# Altium schematic sheet lm7805-power-supply.SchDoc
size 420 x 297 mm; Author: ALTIUM GOSTBOM2.0 KEV; SheetNumber: 1; SheetTotal: 1
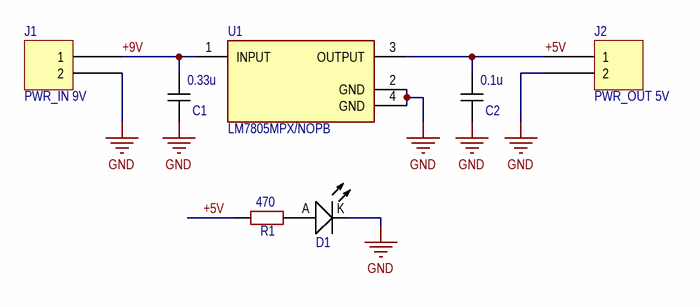
[diagram p0: lm7805-power-supply.SchDoc]

## Parts
C1  0.33u  [CAP_CER_1206]
C2  0.1u  [CAP_CER_1206]
D1  Bl 0603  [LED-0603-BLUE]  (value not drawn)
J1  PWR_IN 9V  [TE 282837-2]
J2  PWR_OUT 5V  [TE 282837-2]
R1  470  [RESC1608(0603)N]
U1  LM7805MPX/NOPB  [FP-LM7805MPX-NOPB-MFG]

## Nets
GND: C1.1 C2.1 D1.K J1.2 J2.2 U1.2(GND) U1.4(GND)
+5V: C2.2 J2.1 R1.1 U1.3(OUTPUT)
+9V: C1.2 J1.1 U1.1(INPUT)
NetD1_A: D1.A R1.2

## Notes on the sheet
- Перв. примен.
- Справ. №
- Подп. дата
- Инв. № дубл.
- Взам. инв. №
- Подп. и дата
- Изм.
- Разраб.
- Лист
- № докум.
- Подп.
- Дата
- Лит.
- Масса
- Масштаб
- Пров.
- Т.контр.
- Листов
- Инв. № подл.
- Н.контр.
- Утв.
- ALTIUM GOSTBOM2.0 KEV
- Файл:
- Копировал
- Формат А3

## Library data of the parts
C1 = CC1206JRX7R9BB334: Cap Cer MLCC SMD 50V 0.33uF X7R 1206 5%; Part Number: CC1206JRX7R9BB334; HelpURL: https://eu.mouser.com/ProductDetail/Yageo/CC1206JRX7R9BB334?qs=sGAEpiMZZMuMW9TJLBQkXoEyHUyRl0r%2FZsPy0jokCYY%3D; Price$: 0.55; Manufacturer Part Number: CC1206JRX7R9BB334; Package: 1206; Mouser Part Number: 603-CC1206JR9BB334
C2 = C3216C0G1H104J160AA: Cap Cer MLCC SMD 50V 0.1uF C0G NP0 1206 5%; Part Number: C3216C0G1H104J160AA; HelpURL: https://eu.mouser.com/ProductDetail/TDK/C3216C0G1H104J160AA?qs=LcTL%2F5vFEzHiuoSy7B0Pmg%3D%3D; Price$: 0.55; Manufacturer Part Number: C3216C0G1H104J160AA; Package: 1206; Mouser Part Number: 810-C3216C0G1H104J
D1 = 150060BS55040: LED BLUE DIFFUSED 0603 SMD; Part Number: 150060BS55040; HelpURL: https://www.digikey.com/products/en?keywords=732-12013-1-ND; Digi-Key Part Number: 732-12013-1-ND; Manufacturer Part Number: 150060BS55040; Package: 0603
J1 J2 = 282837-2: TERM BLK 2P SIDE ENT 5.08MM PCB; Manufacturer: TE Connectivity AMP Connectors; Current: 13.5 A; Mating Orientation: Horizontal with Board; Number of Levels: 1; Pitch: 0.200" (5.08mm); Positions Per Level: 2; Voltage: 300 V; Wire Gauge: 16-28 AWG; Wire Termination: Screw - Rising Cage Clamp; Part Number: 282837-2; Color: Green; ComponentLink1Description: Datasheet; ComponentLink1URL: https://www.te.com/commerce/DocumentDelivery/DDEController?Action=srchrtrv&DocNm=282837&DocType=Customer+Drawing&DocLang=English; ComponentLink2Description: DigiKey Link; ComponentLink2URL: https://www.digikey.com/en/products/detail/te-connectivity-amp-connectors/282837-2/2187973; Features: Interlocking (Side); LastUpdated: 21.06.2022 15:00:23; Lifecycle Status: Active; Minimum Order: 1; Mounting Type: Through Hole; Packaging: Tray; Part Status: Active; Price: 0.31; Series: Buchanan; Supplier 1: DigiKey; Supplier Part Number 1: A113320-ND
R1 = RN731JTTD4700D25: RES SMD 0603 470  0.5% 25ppm; Part Number: RN731JTTD4700D25; HelpURL: https://eu.mouser.com/ProductDetail/KOA-Speer/RN731JTTD4700D25?qs=sGAEpiMZZMvdGkrng054tzPYU%252Blienw%2FVZ0eChuFudU%3D; Manufacturer Part Number: RN731JTTD4700D25; Package: 0603; Mouser Part Number: 660-RN731JTTD4700D25
U1 = CMP-04917-000022-1: IC REG LINEAR 5V 1.5A SOT223-4; Manufacturer: Texas Instruments; Dropout Voltage: 2V; Output Type: Fixed; Accuracy Percentage: 3%; Nominal Supply Current: 8mA; Standoff Height: 0.02mm; Min Supply Voltage: 7.5V; Number Of Outputs: 1; Max Junction Temp: +150°C; Max Supply Voltage: 30V; Height: 1.8mm; Temperature Range High: +125°C; Device Class L3: Voltage Regulators - Linear; Lead Free: Yes; Digikey Description: IC REG LINEAR 5V 1.5A SOT223-4; Output Current: 1.5A; Manufacturer Part Number: LM7805MPX/NOPB; Automotive: No; Device Class L1: Integrated Circuits (ICs); ComponentLink2Description: Datasheet; Device Class L2: Power Management ICs; Category: IC; Octopart: https://octopart.com/lm7805mpx%2Fnopb-texas+instruments-74629992; Package: SOT223-4; RoHS: TRUE; Output Voltage: 5V; Temperature Range Low: 0°C; Temperature: 0°C to +125°C; ComponentLink2URL: http://www.ti.com/lit/ds/symlink/lm7800.pdf